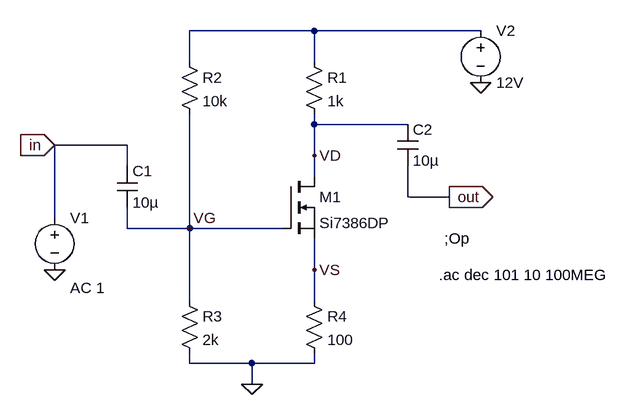
[diagram p0: schematic che do A.asc]
che do A.asc, the LTspice schematic file:
Version 4
SHEET 1 880 680
WIRE 192 16 0 16
WIRE 448 16 192 16
WIRE 0 64 0 16
WIRE 192 64 192 16
WIRE 192 160 192 144
WIRE 336 160 192 160
WIRE -96 192 -208 192
WIRE 192 208 192 160
WIRE -96 224 -96 192
WIRE 192 240 192 208
WIRE 336 272 336 224
WIRE 400 272 336 272
WIRE -208 304 -208 192
WIRE -96 320 -96 288
WIRE 0 320 0 144
WIRE 0 320 -96 320
WIRE 144 320 0 320
WIRE 192 384 192 336
WIRE 0 432 0 320
WIRE 192 432 192 384
WIRE 0 528 0 512
WIRE 96 528 0 528
WIRE 192 528 192 512
WIRE 192 528 96 528
WIRE 96 560 96 528
FLAG 448 96 0
FLAG -208 384 0
FLAG 96 560 0
FLAG 0 320 VG
FLAG 192 384 VS
FLAG 192 208 VD
FLAG 400 272 out
IOPIN 400 272 Out
FLAG -208 192 in
IOPIN -208 192 In
SYMBOL res 176 48 R0
SYMATTR InstName R1
SYMATTR Value 1k
SYMBOL res -16 48 R0
SYMATTR InstName R2
SYMATTR Value 10k
SYMBOL res -16 416 R0
SYMATTR InstName R3
SYMATTR Value 2k
SYMBOL res 176 416 R0
SYMATTR InstName R4
SYMATTR Value 100
SYMBOL nmos 144 240 R0
SYMATTR InstName M1
SYMATTR Value Si7386DP
SYMBOL cap 320 160 R0
SYMATTR InstName C2
SYMATTR Value 10µ
SYMBOL voltage -208 288 R0
WINDOW 3 -48 153 Left 2
WINDOW 123 24 124 Left 2
WINDOW 39 0 0 Left 0
SYMATTR Value ""
SYMATTR Value2 AC 1
SYMATTR InstName V1
SYMBOL voltage 448 0 R0
WINDOW 123 0 0 Left 0
WINDOW 39 0 0 Left 0
SYMATTR InstName V2
SYMATTR Value 12V
SYMBOL cap -112 224 R0
SYMATTR InstName C1
SYMATTR Value 10µ
TEXT 384 392 Left 2 !.ac dec 101 10 100MEG
TEXT 392 336 Left 2 !;Op

The netlist it stands for:
* che do A.asc
R1 N001 VD 1k
R2 N001 VG 10k
R3 VG 0 2k
R4 VS 0 100
M1 VD VG VS VS Si7386DP
C2 VD out 10µ
V1 in 0 AC 1
V2 N001 0 12V
C1 in VG 10µ
.model NMOS NMOS
.model PMOS PMOS
.lib standard.mos
.ac dec 101 10 100MEG
;Op
.backanno
.end